# EAGLE design ad8334 (EAGLE 9.5.1)
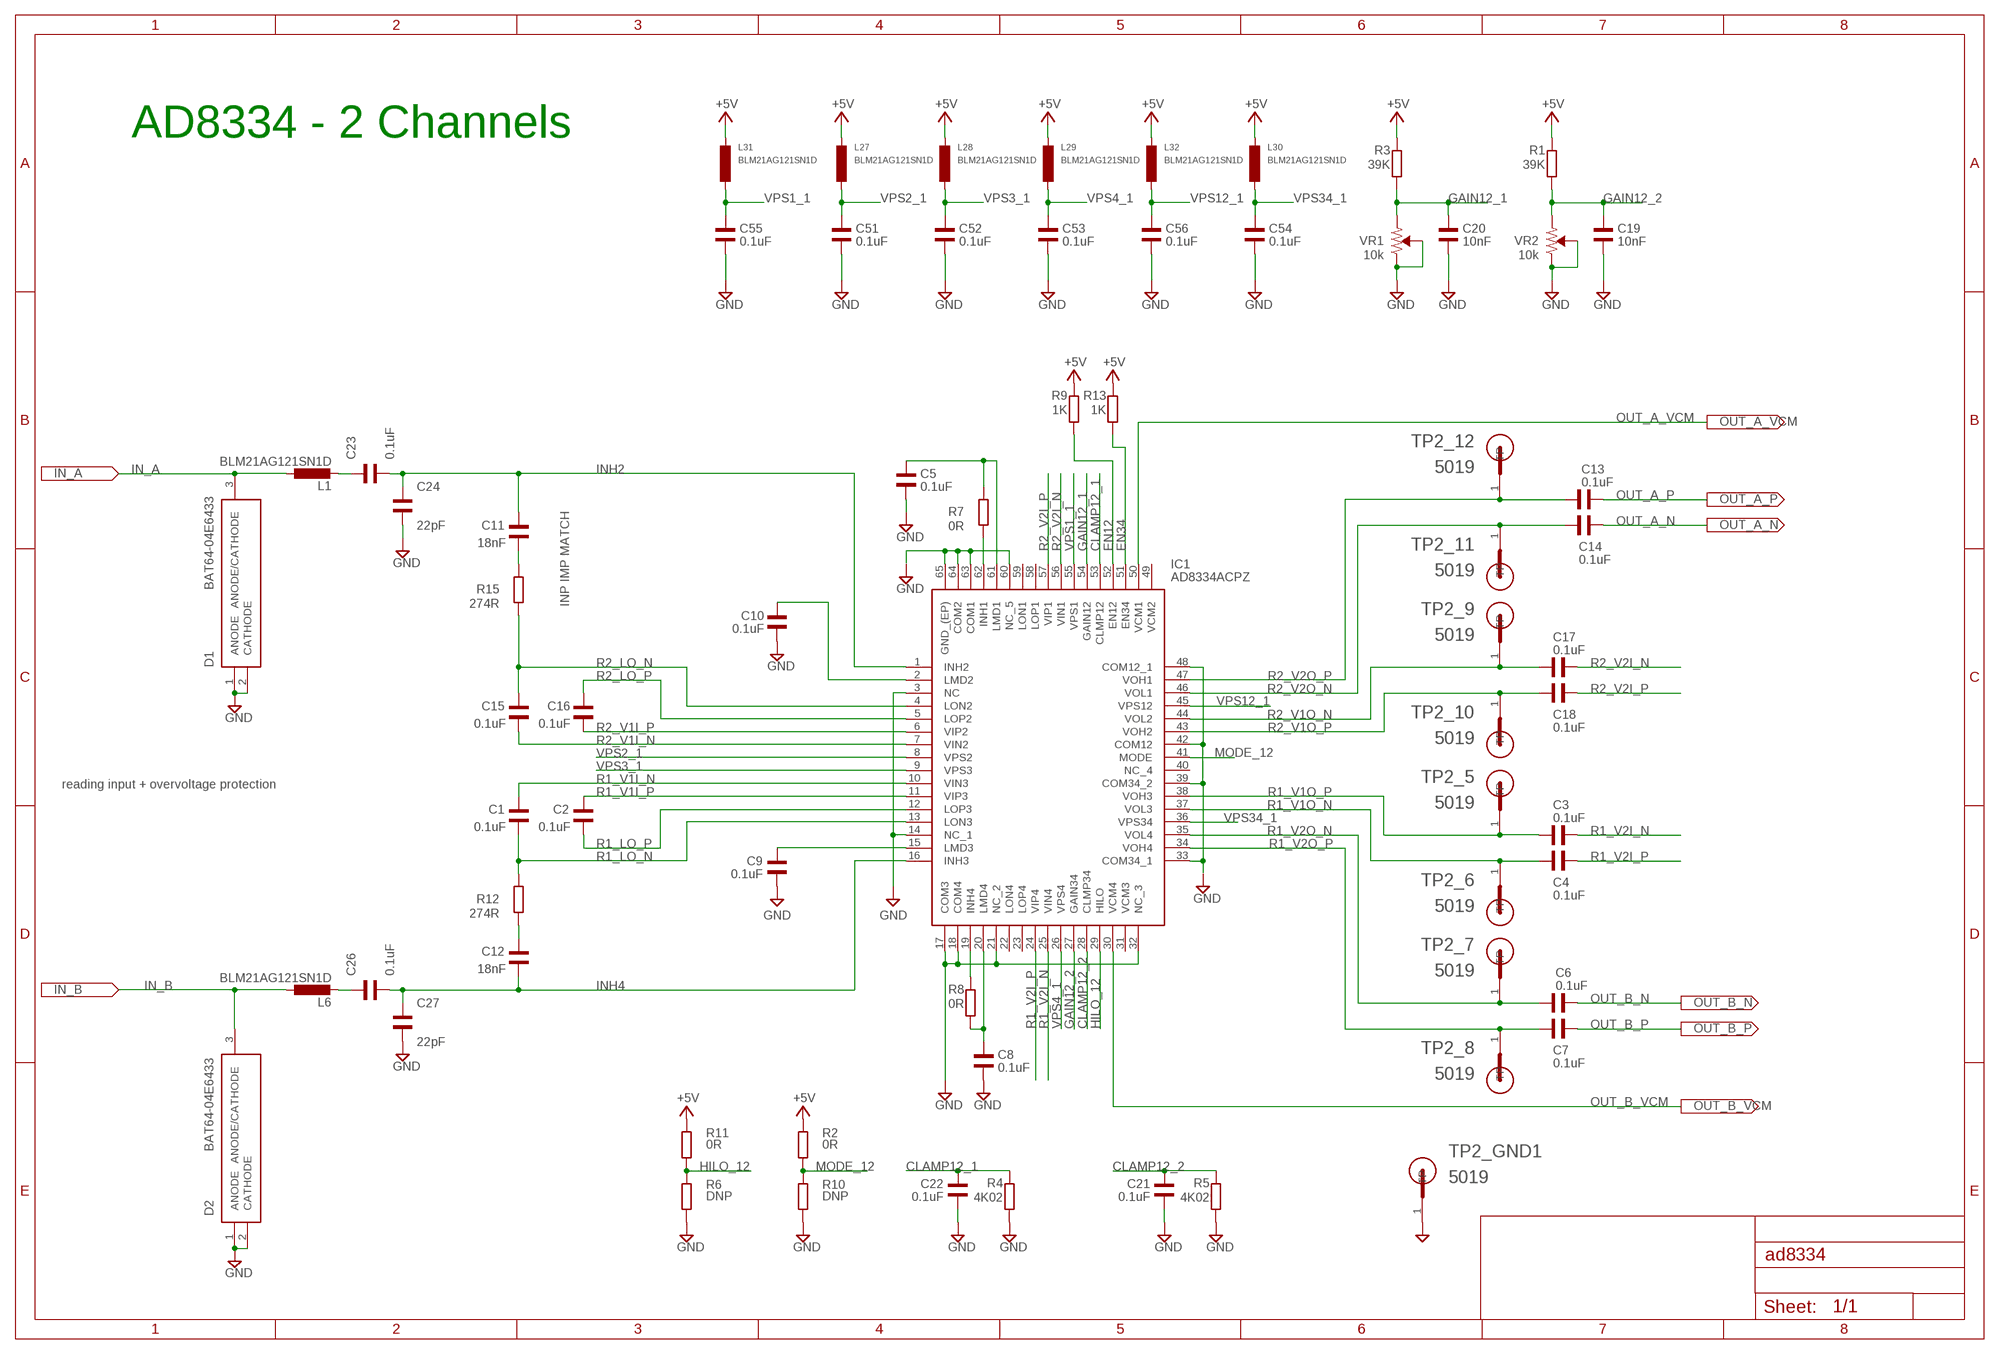
[diagram p0: schematic, sheet 1]
SUPPLY5 (V-->): NET: IN_A
SUPPLY8 (V-->): NET: IN_B
SUPPLY9 (V-->): NET: OUT_A_VCM
SUPPLY10 (V-->): NET: OUT_B_VCM
SUPPLY15 (V-->): NET: OUT_A_P
SUPPLY16 (V-->): NET: OUT_A_N
SUPPLY17 (V-->): NET: OUT_B_N
SUPPLY18 (V-->): NET: OUT_B_P

## Parts
C1  0.1uF  WCAP-CSGP_0402_885012205037  [WCAP-CSGP_0402]
C2  0.1uF  WCAP-CSGP_0402_885012205037  [WCAP-CSGP_0402]
C3  0.1uF  WCAP-CSGP_0402_885012205037  [WCAP-CSGP_0402]
C4  0.1uF  WCAP-CSGP_0402_885012205037  [WCAP-CSGP_0402]
C5  0.1uF  WCAP-CSGP_0402_885012205037  [WCAP-CSGP_0402]
C6  0.1uF  WCAP-CSGP_0402_885012205037  [WCAP-CSGP_0402]
C7  0.1uF  WCAP-CSGP_0402_885012205037  [WCAP-CSGP_0402]
C8  0.1uF  WCAP-CSGP_0402_885012205037  [WCAP-CSGP_0402]
C9  0.1uF  WCAP-CSGP_0402_885012205037  [WCAP-CSGP_0402]
C10  0.1uF  WCAP-CSGP_0402_885012205037  [WCAP-CSGP_0402]
C11  18nF  WCAP-CSGP_0402_885012205037  [WCAP-CSGP_0402]
C12  18nF  WCAP-CSGP_0402_885012205037  [WCAP-CSGP_0402]
C13  0.1uF  WCAP-CSGP_0402_885012205037  [WCAP-CSGP_0402]
C14  0.1uF  WCAP-CSGP_0402_885012205037  [WCAP-CSGP_0402]
C15  0.1uF  WCAP-CSGP_0402_885012205037  [WCAP-CSGP_0402]
C16  0.1uF  WCAP-CSGP_0402_885012205037  [WCAP-CSGP_0402]
C17  0.1uF  WCAP-CSGP_0402_885012205037  [WCAP-CSGP_0402]
C18  0.1uF  WCAP-CSGP_0402_885012205037  [WCAP-CSGP_0402]
C19  10nF  WCAP-CSGP_0402_885012205037  [WCAP-CSGP_0402]
C20  10nF  WCAP-CSGP_0402_885012205037  [WCAP-CSGP_0402]
C21  0.1uF  WCAP-CSGP_0402_885012205037  [WCAP-CSGP_0402]
C22  0.1uF  WCAP-CSGP_0402_885012205037  [WCAP-CSGP_0402]
C23  0.1uF  WCAP-CSGP_0402_885012205037  [WCAP-CSGP_0402]
C24  22pF  WCAP-CSGP_0402_885012005009  [WCAP-CSGP_0402]
C26  0.1uF  WCAP-CSGP_0402_885012205037  [WCAP-CSGP_0402]
C27  22pF  WCAP-CSGP_0402_885012005009  [WCAP-CSGP_0402]
C51  0.1uF  WCAP-CSGP_0402_885012205037  [WCAP-CSGP_0402]
C52  0.1uF  WCAP-CSGP_0402_885012205037  [WCAP-CSGP_0402]
C53  0.1uF  WCAP-CSGP_0402_885012205037  [WCAP-CSGP_0402]
C54  0.1uF  WCAP-CSGP_0402_885012205037  [WCAP-CSGP_0402]
C55  0.1uF  WCAP-CSGP_0402_885012205037  [WCAP-CSGP_0402]
C56  0.1uF  WCAP-CSGP_0402_885012205037  [WCAP-CSGP_0402]
D1  BAT64-04E6433  [SOT95P260X110-3N]
D2  BAT64-04E6433  [SOT95P260X110-3N]
IC1  AD8334ACPZ  [QFN50P900X900X100-65N]
L1  BLM21AG121SN1D  L-EUL2012C  [L2012C]
L6  BLM21AG121SN1D  L-EUL2012C  [L2012C]
L27  BLM21AG121SN1D  L-EUL2012C  [L2012C]
L28  BLM21AG121SN1D  L-EUL2012C  [L2012C]
L29  BLM21AG121SN1D  L-EUL2012C  [L2012C]
L30  BLM21AG121SN1D  L-EUL2012C  [L2012C]
L31  BLM21AG121SN1D  L-EUL2012C  [L2012C]
L32  BLM21AG121SN1D  L-EUL2012C  [L2012C]
R1  39K  R-EU_R0402  [R0402]
R2  0R  R-EU_R0402  [R0402]
R3  39K  R-EU_R0402  [R0402]
R4  4K02  R-EU_R0402  [R0402]
R5  4K02  R-EU_R0402  [R0402]
R6  DNP  R-EU_R0402  [R0402]
R7  0R  R-EU_R0402  [R0402]
R8  0R  R-EU_R0402  [R0402]
R9  1K  R-EU_R0402  [R0402]
R10  DNP  R-EU_R0402  [R0402]
R11  0R  R-EU_R0402  [R0402]
R12  274R  R-EU_R0402  [R0402]
R13  1K  R-EU_R0402  [R0402]
R15  274R  R-EU_R0402  [R0402]
TP2_5  5019  [TP380X203]
TP2_6  5019  [TP380X203]
TP2_7  5019  [TP380X203]
TP2_8  5019  [TP380X203]
TP2_9  5019  [TP380X203]
TP2_10  5019  [TP380X203]
TP2_11  5019  [TP380X203]
TP2_12  5019  [TP380X203]
TP2_GND1  5019  [TP380X203]
VR1  10k  TRIMPOT-SMD-3MM-OPEN-1/10W-25%  [TRIMPOT-SMD-TC33X]
VR2  10k  TRIMPOT-SMD-3MM-OPEN-1/10W-25%  [TRIMPOT-SMD-TC33X]

## Nets
+5V [power]: L27.1 L28.1 L29.1 L30.1 L31.1 L32.1 R1.2 R2.2 R3.2 R9.2 R11.2 R13.2
CLAMP12_1: C22.1 IC1.53(CLMP12) R4.2
CLAMP12_2: C21.1 IC1.28(CLMP34) R5.2
EN12: IC1.52(EN12) R9.1
EN34: IC1.51(EN34) R13.1
GAIN12_1: C20.1 IC1.54(GAIN12) R3.1 VR1.3(CCW)
GAIN12_2: C19.1 IC1.27(GAIN34) R1.1 VR2.3(CCW)
GND [power]: C5.2 C8.1 C9.1 C10.1 C19.2 C20.2 C21.2 C22.2 C24.1 C27.1 C51.1 C52.1 C53.1 C54.1 C55.1 C56.1 D1.1(ANODE) D1.2(CATHODE) D2.1(ANODE) D2.2(CATHODE) IC1.3(NC) IC1.14(NC_1) IC1.17(COM3) IC1.18(COM4) IC1.21(NC_2) IC1.32(NC_3) IC1.60(NC_5) IC1.63(COM1) IC1.64(COM2) IC1.65(GND_(EP)) R4.1 R5.1 R6.1 R10.1 TP2_GND1.1(TP) VR1.1(CW) VR1.2(WIPER) VR2.1(CW) VR2.2(WIPER)
HILO_12: IC1.29(HILO) R6.2 R11.1
IN_A: D1.3(ANODE/CATHODE) L1.1
IN_B [power]: D2.3(ANODE/CATHODE) L6.1
INH2: C11.2 C23.1 C24.2 IC1.1(INH2)
INH4: C12.1 C26.1 C27.2 IC1.16(INH3)
MODE_12: IC1.41(MODE) R2.1 R10.2
N$1: C5.1 IC1.61(LMD1) R7.2
N$2: C8.2 IC1.20(LMD4) R8.1
N$4 [power]: IC1.33(COM34_1) IC1.39(COM34_2) IC1.42(COM12) IC1.48(COM12_1)
N$5: C10.2 IC1.2(LMD2)
N$6: C9.2 IC1.15(LMD3)
N$11: C23.2 L1.2
N$12: C11.1 R15.2
N$13: C26.2 L6.2
N$14: C12.2 R12.1
N$15: IC1.19(INH4) R8.2
OUT_A_N: C14.2
OUT_A_P: C13.2
OUT_A_VCM: IC1.50(VCM1)
OUT_B_N: C6.2
OUT_B_P: C7.2
OUT_B_VCM: IC1.30(VCM4)
R1_I: IC1.62(INH1) R7.1
R1_LO_N: C1.1 IC1.13(LON3) R12.2
R1_LO_P: C2.1 IC1.12(LOP3)
R1_V1I_N: C1.2 IC1.10(VIN3)
R1_V1I_P: C2.2 IC1.11(VIP3)
R1_V1O_N: C4.1 IC1.37(VOL3) TP2_6.1(TP)
R1_V1O_P: C3.1 IC1.38(VOH3) TP2_5.1(TP)
R1_V2I_N: C3.2 IC1.25(VIN4)
R1_V2I_P: C4.2 IC1.24(VIP4)
R1_V2O_N: C6.1 IC1.35(VOL4) TP2_7.1(TP)
R1_V2O_P: C7.1 IC1.34(VOH4) TP2_8.1(TP)
R2_LO_N: C15.2 IC1.4(LON2) R15.1
R2_LO_P: C16.2 IC1.5(LOP2)
R2_V1I_N: C15.1 IC1.7(VIN2)
R2_V1I_P: C16.1 IC1.6(VIP2)
R2_V1O_N: C17.1 IC1.44(VOL2) TP2_9.1(TP)
R2_V1O_P: C18.1 IC1.43(VOH2) TP2_10.1(TP)
R2_V2I_N: C17.2 IC1.56(VIN1)
R2_V2I_P: C18.2 IC1.57(VIP1)
R2_V2O_N: C14.1 IC1.46(VOL1) TP2_11.1(TP)
R2_V2O_P: C13.1 IC1.47(VOH1) TP2_12.1(TP)
VPS1_1: C55.2 IC1.55(VPS1) L31.2
VPS2_1: C51.2 IC1.8(VPS2) L27.2
VPS3_1: C52.2 IC1.9(VPS3) L28.2
VPS4_1: C53.2 IC1.26(VPS4) L29.2
VPS12_1: C56.2 IC1.45(VPS12) L32.2
VPS34_1: C54.2 IC1.36(VPS34) L30.2
Unconnected: IC1.22(LON4) IC1.23(LOP4) IC1.31(VCM3) IC1.40(NC_4) IC1.49(VCM2) IC1.58(LOP1) IC1.59(LON1)

## Notes on the sheet
- AD8334 - 2 Channels
- INP IMP MATCH
- reading input + overvoltage protection

## Library data of the parts
C1-C24 C26 C27 C51-C56 = Wurth_Elektronik_Passive_Capacitors_rev18b:WCAP-CSGP_0402: WCAP-CSGP Ceramic Capacitors Characteristics Multilayer Ceramic Chip Capacitor Recommended soldering:Reflow, for 0603 and 0805 wave soldering is also allowed Operating temperature:-55 °C to +125 °C; Ceramic characteristics: Class I - NPO ; Class II -X7R, X5R High performance ceramic High capacitance stability Minimal aging Termination:Cu/Ni/Sn <http://katalog.we-online.de/media/images/eisos/WCAP-CSGP_pf2.jpg> Details see: http://katalog.we-online.de/en/pbs/WCAP-CSGP-0402? Created: 2015-01-28 2015 (C) Wurth Elektronik
D1 D2 = BAT64-04E6433:BAT64-04E6433: Infineon BAT64-04E6433, Dual SMT Schottky Fast Recovery Diode, Series, 40V 250mA, 5ns, 3-Pin SOT-23 Source: Datasheet <https://www.infineon.com/dgdl/Infineon-BAT64SERIES-DS-v01_01-en.pdf?fileId=db3a304314dca3890115191757980ead>; DESCRIPTION: Infineon BAT64-04E6433, Dual SMT Schottky Fast Recovery Diode, Series, 40V 250mA, 5ns, 3-Pin SOT-23; HEIGHT: 1.1mm; MANUFACTURER_NAME: Infineon; MANUFACTURER_PART_NUMBER: BAT64-04E6433
IC1 = AD8334ACPZ:AD8334ACPZ: AD8334ACPZ, Programmable Gain Amplifier 4, 64-Pin LFCSP VQ Source: Datasheet <http://docs-emea.rs-online.com/webdocs/12fa/0900766b812fac01.pdf>; DESCRIPTION: AD8334ACPZ, Programmable Gain Amplifier 4, 64-Pin LFCSP VQ; HEIGHT: 1mm; MANUFACTURER_NAME: Analog Devices; MANUFACTURER_PART_NUMBER: AD8334ACPZ; MOUSER_PART_NUMBER: 584-AD8334ACPZ; MOUSER_PRICE-STOCK: https://www.mouser.com/Search/Refine.aspx?Keyword=584-AD8334ACPZ; RS_PART_NUMBER: 8099263P; RS_PRICE-STOCK: http://uk.rs-online.com/web/p/products/8099263P
L1 L6 = rcl:L-EU: INDUCTOR, European symbol; SPICEPREFIX: L
L27-L32 = resistor:L-EU: INDUCTOR, European symbol
R1-R13 R15 = resistor:R-EU_: RESISTOR, European symbol
TP2_5-TP2_12 TP2_GND1 = 5019:5019: Test Point, Compact, Surface Mount; AVAILABILITY: Good; DESCRIPTION: Phosphor Bronze Contact Miniature Silver Plated Surface Mount Test Points; MF: Keystone; MP: 5019; PACKAGE: 2010 Keystone; PRICE: 0.18 USD
VR1 VR2 = SparkFun-Resistors:TRIMPOT: Trimming Potentiometer (Trimpot) Three-terminal potentiometers, with an adjustable wiper and two adjustable resistors. A pot can be used to create a configurable voltage divider, or as a variable resistor. "Trimpots" are a subset of potentiometers, usually intended for "set-and-forget" applications. They're often more delicate than standard potentiometers - rated for fewer turns. Variants PTH-KNOB - PTH Trimpot w/ finger-adjustable knob Trimpot 10K with Knob <https://www.sparkfun.com/products/9806> (COM-09806) Datasheet <http://www.sparkfun.com/datasheets/Components/General/TSR-3386.pdf> SMD-3MM-CLOSED-FRAME - SMD 3mm Square Closed-Frame Trimpot Used on e.g. EasyDriver - Stepper Motor Driver <https://www.sparkfun.com/products/12779> Datasheet <http://www.bitechnologies.com/pdfs/22.pdf> (22AR10KTR) SMD-5MM - SMD 5mm Square Closed-Frame Trimpot Used on e.g. IOIO-OTG - V2.2 <https://www.sparkfun.com/products/13613> Datasheet <http://www.vishay.com/docs/51008/ts53.pdf> (TS53YL502MR10) SMD-3MM-1/10W-25% - 3mm Square Open-Frame Trimpot Used on e.g. SparkFun Shapeoko <https://www.sparkfun.com/products/13899> Datasheet <http://www.bourns.com/docs/Product-Datasheets/TC33.pdf> (TC33X-2-103E); PROD_ID: RES-12428

## Net classes
2 power: width 0.4 mm

## Board
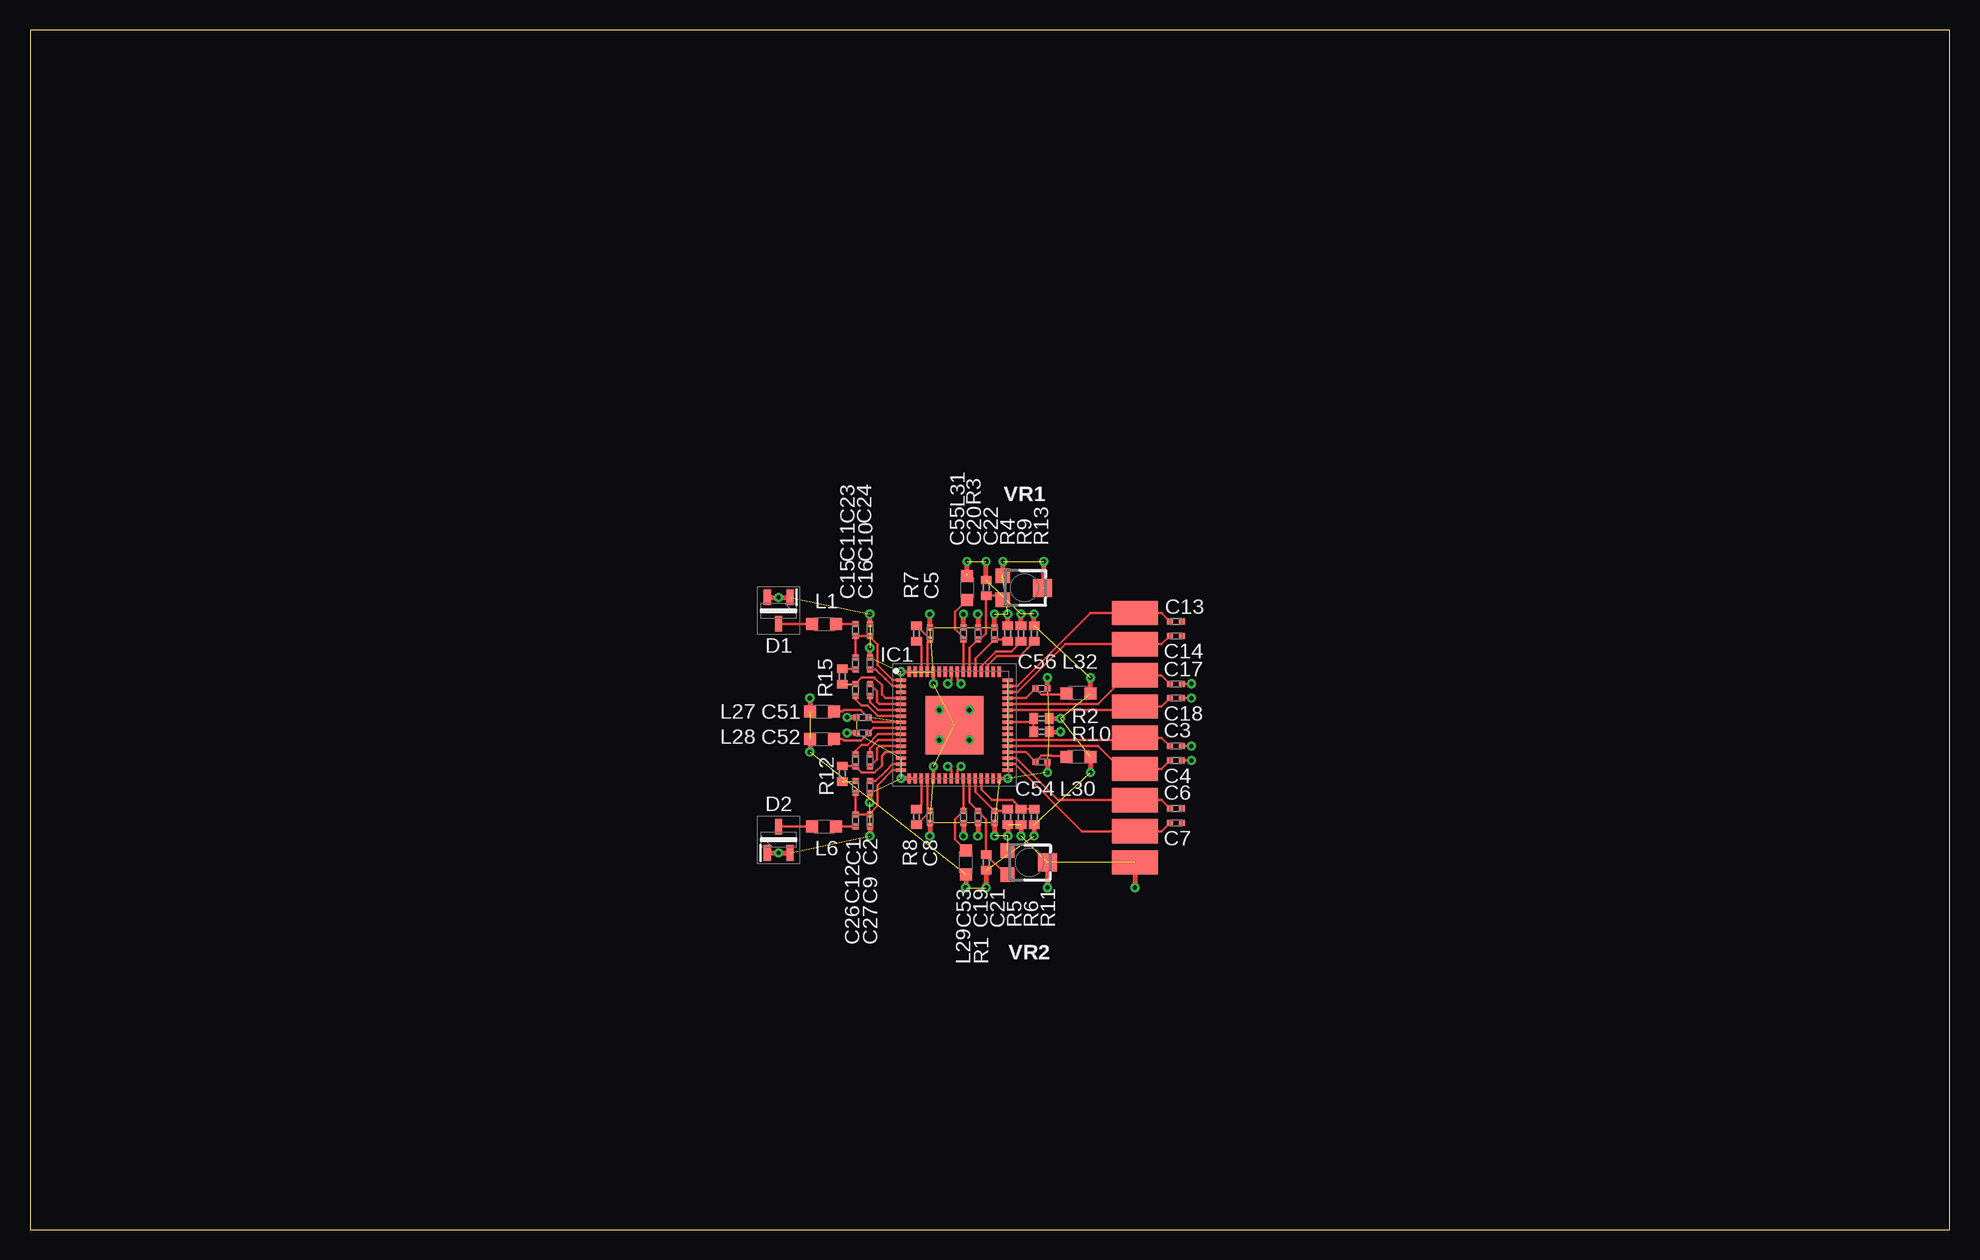
[diagram p1: board, top side]
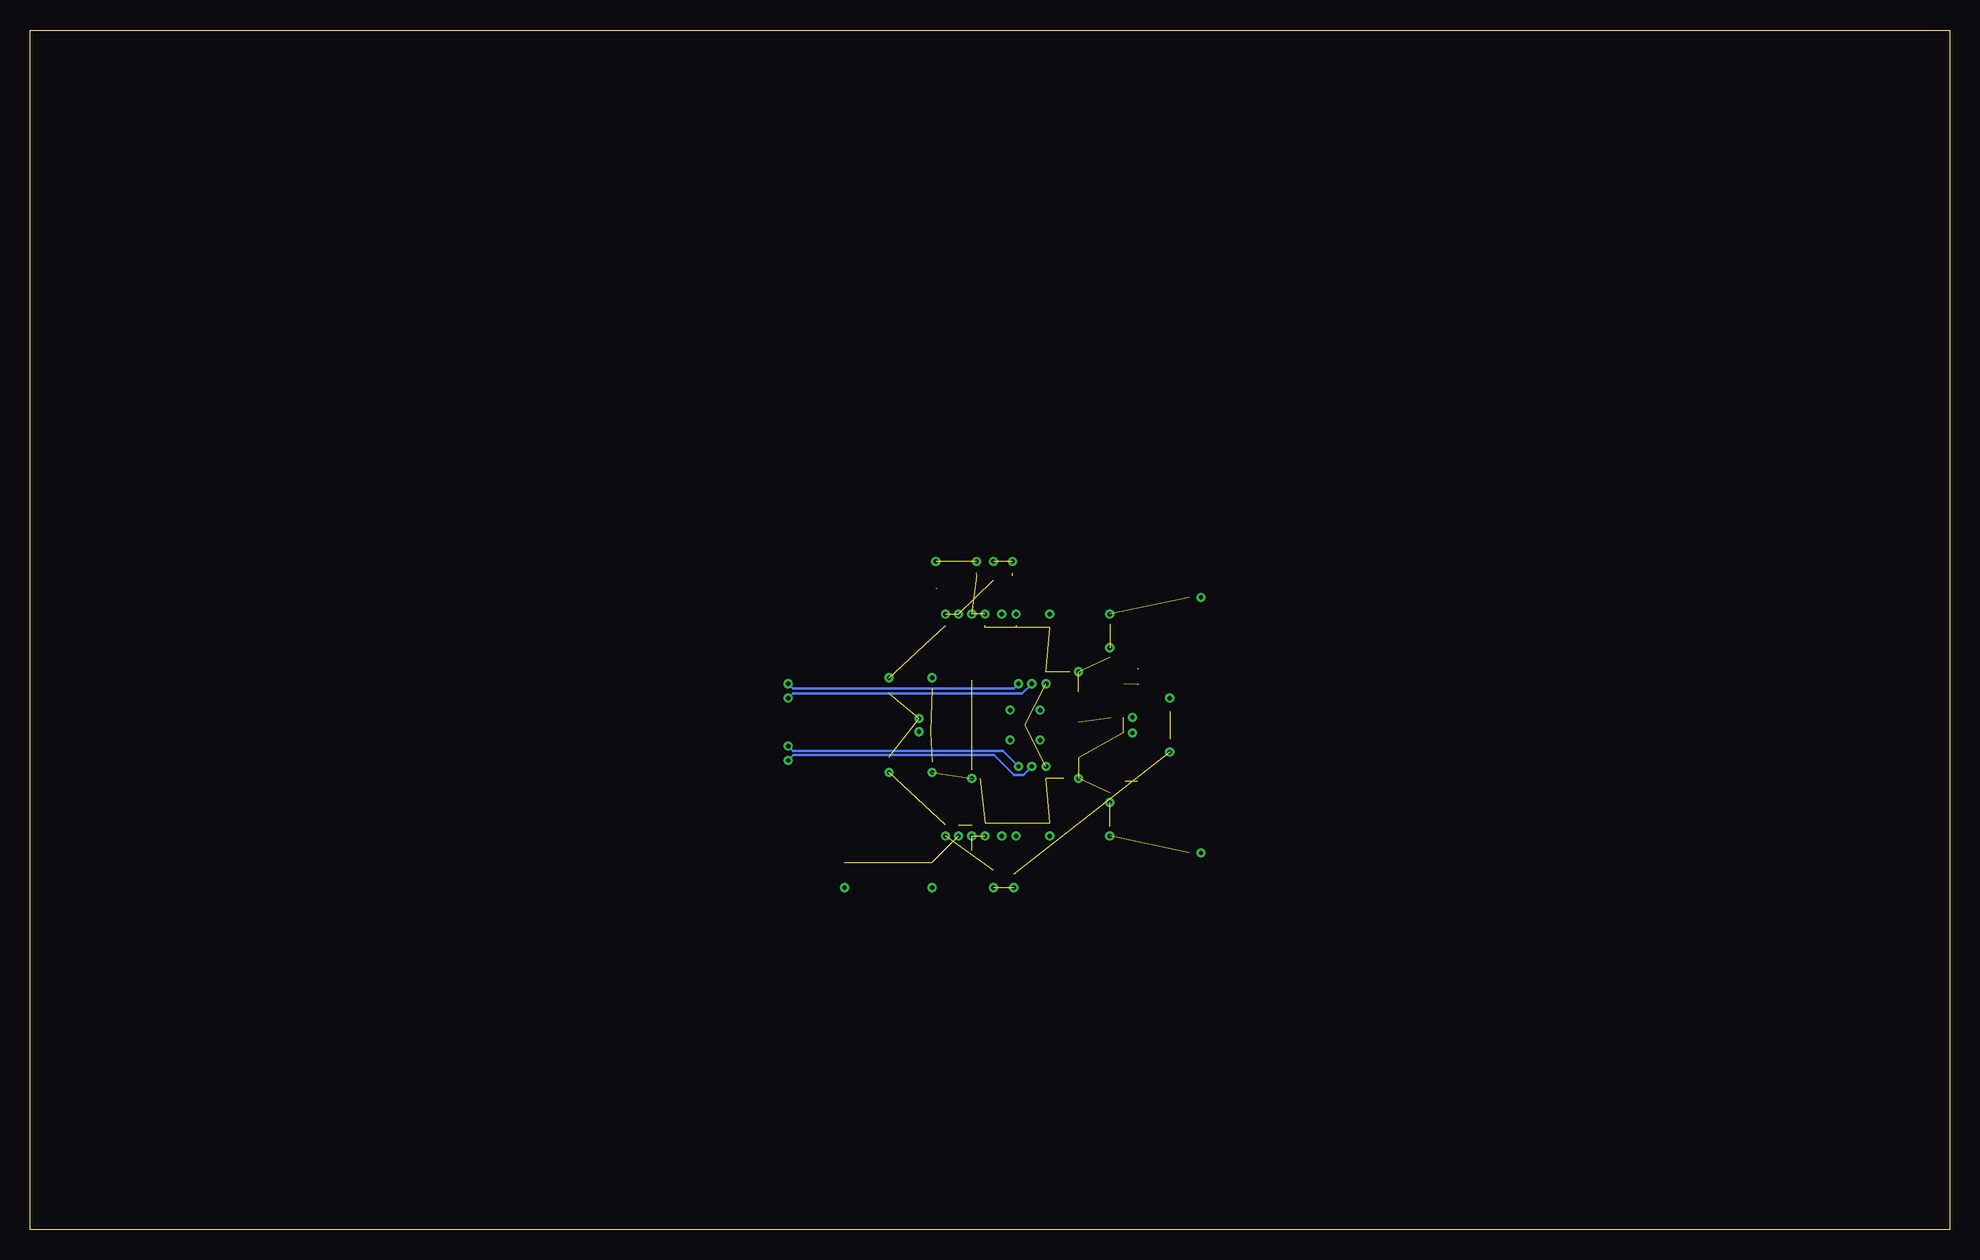
[diagram p2: board, bottom side, seen from below]

Size 160 x 100 mm. Coordinates in mm from the lower left corner, seen from the top.
Outline: 0,0 160,0 160,100 0,100 0,0
Copper layers (1*16): Top 0.035mm / dielectric 1.5mm / Bottom 0.035mm
Design rules "default": minimum track width 6mil, minimum drill 0.35mm, track to track 6mil, track to pad 6mil, pad to pad 6mil, via to via 6mil, smd to smd 6mil, copper to edge 40mil, drill to drill 6mil, minimum pad ring 10mil, minimum via ring 8mil, stop-mask expansion 4mil, vias tented up to drill 0mil, thermal gap 10mil

### Footprints (pad centres in the part's own frame; a part is rotated, then mirrored left to right if it is on the bottom)
WCAP-CSGP_0402 = smd 0.5 x 0.5: 1 -0.5,0; 2 0.5,0
SOT95P260X110-3N = smd 1.3 x 0.6: 1 -1.1,0.95; 2 -1.1,-0.95; 3 1.1,0
QFN50P900X900X100-65N = smd 0.85 x 0.3: 1 -4.45,3.75; 2 -4.45,3.25; 3 -4.45,2.75; 4 -4.45,2.25; 5 -4.45,1.75; 6 -4.45,1.25; 7 -4.45,0.75; 8 -4.45,0.25; 9 -4.45,-0.25; 10 -4.45,-0.75; 11 -4.45,-1.25; 12 -4.45,-1.75; 13 -4.45,-2.25; 14 -4.45,-2.75; 15 -4.45,-3.25; 16 -4.45,-3.75; 33 4.45,-3.75; 34 4.45,-3.25; 35 4.45,-2.75; 36 4.45,-2.25; 37 4.45,-1.75; 38 4.45,-1.25; 39 4.45,-0.75; 40 4.45,-0.25; 41 4.45,0.25; 42 4.45,0.75; 43 4.45,1.25; 44 4.45,1.75; 45 4.45,2.25; 46 4.45,2.75; 47 4.45,3.25; 48 4.45,3.75 | smd 0.3 x 0.85: 17 -3.75,-4.45; 18 -3.25,-4.45; 19 -2.75,-4.45; 20 -2.25,-4.45; 21 -1.75,-4.45; 22 -1.25,-4.45; 23 -0.75,-4.45; 24 -0.25,-4.45; 25 0.25,-4.45; 26 0.75,-4.45; 27 1.25,-4.45; 28 1.75,-4.45; 29 2.25,-4.45; 30 2.75,-4.45; 31 3.25,-4.45; 32 3.75,-4.45; 49 3.75,4.45; 50 3.25,4.45; 51 2.75,4.45; 52 2.25,4.45; 53 1.75,4.45; 54 1.25,4.45; 55 0.75,4.45; 56 0.25,4.45; 57 -0.25,4.45; 58 -0.75,4.45; 59 -1.25,4.45; 60 -1.75,4.45; 61 -2.25,4.45; 62 -2.75,4.45; 63 -3.25,4.45; 64 -3.75,4.45 | smd 4.85 x 4.85: 65 0,0
L2012C = smd 1 x 1: 1 -1,0; 2 1,0
R0402 = smd 0.7 x 0.9: 1 -0.65,0; 2 0.65,0
TP380X203 = smd 3.8 x 2.03: 1 0,0
TRIMPOT-SMD-TC33X = smd 1.2 x 1.2: 1 -1,-1.825; 3 1,-1.825 | smd 1.5 x 1.6: 2 0,1.5

### Placement (x,y rotation side)
C1  68.8,39.1 90 top
C2  70,39.1 90 top
C3  95.5,40.3 0 top
C4  95.5,39.1 0 top
C5  75,49.7 90 top
C6  95.5,35.1 0 top
C7  95.5,33.9 0 top
C8  75,34.4 90 top
C9  70,36.9 90 top
C10  70,47.2 270 top
C11  68.8,47.2 90 top
C12  68.8,36.9 90 top
C13  95.5,50.7 0 top
C14  95.5,49.5 0 top
C15  68.8,45 90 top
C16  70,45 90 top
C17  95.5,45.5 0 top
C18  95.5,44.3 0 top
C19  79,34.4 270 top
C20  79,49.7 90 top
C21  80.4,34.4 270 top
C22  80.4,49.7 90 top
C23  68.8,50 90 top
C24  70,50 270 top
C26  68.8,34.1 270 top
C27  70,34.1 90 top
C51  69.4,42.7 0 top
C52  69.4,41.4 0 top
C53  77.8,34.4 90 top
C54  84.3,39 180 top
C55  77.8,49.7 270 top
C56  84.3,45.1 180 top
D1  62.4,51.6 270 top
D2  62.4,32.5 90 top
IC1  77.05,42.05 0 top
L1  66.2,50.5 0 top
L6  66.2,33.6 0 top
L27  66,43.2 0 top
L28  66,40.9 0 top
L29  78.01,30.6 90 top
L30  87.4,39.4 180 top
L31  78.1,53.5 270 top
L32  87.4,44.7 180 top
R1  79.7,30.6 270 top
R2  84.3,42.6 0 top
R3  79.7,53.5 90 top
R4  81.5,49.7 270 top
R5  81.5,34.4 90 top
R6  82.6,34.4 90 top
R7  73.9,49.7 90 top
R8  73.9,34.4 90 top
R9  82.6,49.7 90 top
R10  84.3,41.5 180 top
R11  83.7,34.4 270 top
R12  67.7,38 90 top
R13  83.7,49.7 90 top
R15  67.7,46.1 90 top
TP2_5  92.1,41 180 top
TP2_6  92.1,38.4 180 top
TP2_7  92.1,35.8 180 top
TP2_8  92.1,33.2 180 top
TP2_9  92.1,46.2 180 top
TP2_10  92.1,43.6 180 top
TP2_11  92.1,48.8 180 top
TP2_12  92.1,51.4 180 top
TP2_GND1  92.1,30.6 180 top
VR1  82.9,53.5 270 top
VR2  83.3,30.6 270 top

### Tracks (layer width: path | path; a pad name or v marks a point on that pad's centre or on a via)
+5V  (via drill 0.35)  (12 unrouted)
  Top 0.4: L28.1 v65,39.8 | v65,44.3 L27.1 | R13.2 v83.7,51.3 | R9.2 v82.6,51.3 | 78.1,54.75 v78.1,55.7 | R3.2 v79.7,55.7 | R11.2 v83.7,32.8 | L29.1 v78.01,28.51 v78,28.5 | R1.2 v79.7,28.5 | L32.1 v88.4,46 | L30.1 v88.4,38.1 | R2.2 v85.9,42.6
CLAMP12_1
  Top 0.2: IC1.53 78.8,47.6 C22.1 81.35,49.2 R4.2
CLAMP12_2
  Top 0.2: IC1.28 78.8,36.5 C21.1 81.35,34.9 R5.2
EN12
  Top 0.2: IC1.52 79.3,47 80.5,48.2 81.81,48.2 82.6,48.99 R9.1
EN34
  Top 0.2: IC1.51 79.8,47 80.6,47.8 82.5,47.8 83.15,48.45 83.16,48.45 83.7,48.99 R13.1
GAIN12_1
  Top 0.2: IC1.54 78.3,48.5 C20.1 79.2,49.2 79.7,49.7 R3.1 80.72,52.85 VR1.3
GAIN12_2
  Top 0.2: IC1.27 78.3,35.6 C19.1 79.7,34.2 R1.1 81.35,29.6 VR2.3
GND  (via drill 0.35)  (41 unrouted)
  Top 0.3: IC1.17 IC1.18 | IC1.63 v72.6,46.5 | IC1.60 v75.3,45.5 | IC1.21 v75.3,38.6 | IC1.32 v81.5,37.6
  Top 0.4: C9.1 v70,35.6 | C52.1 v68.1,41.4 | C27.1 v70,32.8 | C10.1 v70,48.5 | C24.1 v70,51.3 | D2.1 v62.4,31.4 D2.2 | D1.2 v62.4,52.7 D1.1 | C5.2 v75,51.3 | R4.1 v81.5,51.3 | 80.4,50.35 v80.4,51.3 | v79,51.3 79,50.25 | 77.8,50.35 v77.8,51.3 | 81.1,54.75 v81.1,55.7 | 84.5,53.45 v84.5,55.7 | C8.1 v75,32.8 | C53.1 v77.8,32.8 | C19.2 v79,32.8 | C21.2 v80.4,32.8 | R5.1 v81.5,32.8 | R6.1 v82.6,32.8 | VR2.2 v84.8,28.5 84.8,28.4 | TP2_GND1.1 v92.1,28.5 92.1,28.4 | IC1.17 v72.6,37.6 | C56.1 v84.8,46 | C54.1 v84.8,38.1 | R10.1 v85.9,41.5
  Top 0.406: C51.1 v68.1,42.7
HILO_12
  Top 0.2: IC1.29 79.3,36.7 80.2,35.8 81.9,35.8 82.05,35.65 82.06,35.65 82.6,35.11 R6.2 R11.1
IN_A
  Top 0.2: D1.3 L1.1
IN_B
  Top 0.2: D2.3 L6.1
INH2
  Top 0.2: IC1.1 71.9,45.8 70.63,47.07 70.63,48.76 70,49.39 C24.2 C23.1 C11.2
INH4
  Top 0.2: IC1.16 71.9,38.3 70.63,37.03 70.63,35.34 70,34.71 C27.2 C26.1 C12.1
MODE_12
  Top 0.2: IC1.41 83.35,42.3 R2.1 R10.2
N$1
  Top 0.2: R7.2 75,49.25 C5.1 74.8,49 IC1.61
N$2
  Top 0.2: R8.1 75,34.85 C8.2 74.8,35.1 IC1.20
N$3  (via drill 0.35)
  other vias: 75.8,40.8
N$4  (3 unrouted)
N$5
  Top 0.2: IC1.2 71.9,45.3 71.3,45.9 70.5,46.7 C10.2
N$6
  Top 0.2: IC1.15 71.9,38.8 71.3,38.2 70.5,37.4 C9.2
N$7  (via drill 0.35)
  other vias: 78.3,40.8
N$8  (via drill 0.35)
  other vias: 78.3,43.3
N$9  (via drill 0.35)
  other vias: 75.8,43.3
N$11
  Top 0.2: C23.2 L1.2
N$12  (1 unrouted)
  Top 0.2: C11.1 68.75,46.75 67.6,46.75
N$13
  Top 0.2: C26.2 L6.2
N$14  (1 unrouted)
  Top 0.2: C12.2 68.75,37.35
N$15
  Top 0.2: IC1.19 74.3,35.45 R8.2
R1_I
  Top 0.2: IC1.62 74.3,48.65 R7.1
R1_LO_N
  Top 0.2: IC1.13 71.3,39.8 71,39.5 71,38.7 70.4,38.1 70.36,38.1 69.3,38.1 C1.1 68.75,38.65 R12.2
R1_LO_P
  Top 0.2: IC1.12 70.8,40.3 70.6,40.1 70.6,39.2 C2.1
R1_V1I_N
  Top 0.2: IC1.10 70.7,41.3 69.8,40.4 69.3,40.4 68.8,39.9 C1.2
R1_V1I_P
  Top 0.2: IC1.11 70.7,40.8 70,40.1 C2.2
R1_V1O_N
  Top 0.2: IC1.37 89,40.3 91,38.3 92,38.3 TP2_6.1 94.3,38.4 C4.1
R1_V1O_P
  Top 0.2: IC1.38 91.9,40.8 TP2_5.1 94.3,41 C3.1
R1_V2I_N  (via drill 0.35)
  Top 0.2: C3.2 v96.8,40.3 96.9,40.3 | IC1.25 77.3,38.3 v77.6,38.6
  Bottom 0.2: v96.8,40.3 96.4,39.9 78.9,39.9 v77.6,38.6
R1_V2I_P  (via drill 0.35)
  Top 0.2: C4.2 v96.8,39.1 | IC1.24 76.8,38.3 v76.5,38.6
  Bottom 0.2: v96.8,39.1 96.35,39.55 79.65,39.55 78,37.9 77.2,37.9 v76.5,38.6
R1_V2O_N
  Top 0.2: IC1.35 82.2,39.3 85.7,35.8 TP2_7.1 94.3,35.8 C6.1
R1_V2O_P
  Top 0.2: IC1.34 82.1,38.8 87.7,33.2 TP2_8.1 94.3,33.2 C7.1
R2_LO_N  (2 unrouted)
  Top 0.2: IC1.4 71.3,44.3 71,44.6 71,45.4 70.4,46 70.36,46 69.3,46 68.75,45.45 67.6,45.45
R2_LO_P
  Top 0.2: IC1.5 70.8,43.8 70.6,44 70.6,44.9 C16.2
R2_V1I_N
  Top 0.2: IC1.7 70.7,42.8 69.8,43.7 69.3,43.7 68.8,44.2 C15.1
R2_V1I_P
  Top 0.2: IC1.6 70.7,43.3 70,44 C16.1
R2_V1O_N
  Top 0.2: IC1.44 89,43.8 91.4,46.2 TP2_9.1 94.3,46.2 C17.1
R2_V1O_P
  Top 0.2: IC1.43 83.19,43.3 84.11,43.3 84.49,43.3 84.5,43.3 85.41,43.3 91.8,43.3 TP2_10.1 94.3,43.6 C18.1
R2_V2I_N  (via drill 0.35)
  Top 0.2: IC1.56 77.3,45.8 v77.6,45.5 | C17.2 v96.8,45.5
  Bottom 0.2: v96.8,45.5 96.4,45.1 78,45.1 v77.6,45.5
R2_V2I_P  (via drill 0.35)
  Top 0.2: IC1.57 76.8,45.8 v76.5,45.5 | C18.2 v96.8,44.3
  Bottom 0.2: v76.5,45.5 77.3,44.7 96.4,44.7 v96.8,44.3
R2_V2O_N
  Top 0.2: IC1.46 82.3,44.8 86.3,48.8 TP2_11.1 94.3,48.8 C14.1
R2_V2O_P
  Top 0.2: IC1.47 82.3,45.3 88.4,51.4 TP2_12.1 94.3,51.4 C13.1
VPS1_1
  Top 0.2: IC1.55 C55.2 77.8,49.34 77.1,50.05 77.1,51.5 L31.2
VPS2_1  (1 unrouted)
  Top 0.2: L27.2 67.71,43.2 67.84,43.33 69.22,43.33 70.25,42.3 IC1.8
VPS3_1
  Top 0.2: L28.2 67.71,40.9 67.84,40.77 69.27,40.77 C52.2 70.3,41.8 IC1.9
VPS4_1
  Top 0.2: IC1.26 C53.2 77.1,34.2 77.1,32.51 L29.2
VPS12_1
  Top 0.2: IC1.45 83,44.3 C56.2 84.3,44.6 86.25,44.6 86.36,44.7 L32.2
VPS34_1
  Top 0.2: IC1.36 83,39.8 C54.2 84.3,39.5 85.16,39.5 86.3,39.5 L30.2